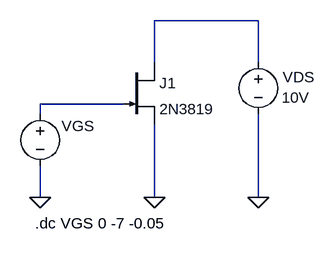
[diagram p0: schematic 2N3819_2.asc]
2N3819_2.asc, the LTspice schematic file:
Version 4.1
SHEET 1 880 680
WIRE 416 32 256 32
WIRE 256 96 256 32
WIRE 416 96 416 32
WIRE 208 160 80 160
WIRE 80 176 80 160
WIRE 80 304 80 256
WIRE 256 304 256 192
WIRE 416 304 416 176
FLAG 256 304 0
FLAG 416 304 0
FLAG 80 304 0
SYMBOL njf 208 96 R0
SYMATTR InstName J1
SYMATTR Value 2N3819
SYMBOL voltage 80 160 R0
WINDOW 0 33 34 Left 2
WINDOW 3 65 175 Left 2
SYMATTR InstName VGS
SYMATTR Value ""
SYMBOL voltage 416 80 R0
WINDOW 0 38 39 Left 2
WINDOW 3 36 70 Left 2
WINDOW 123 0 0 Left 0
WINDOW 39 0 0 Left 0
SYMATTR InstName VDS
SYMATTR Value 10V
TEXT 72 344 Left 2 !.dc VGS 0 -7 -0.05

The netlist it stands for:
* 2N3819_2.asc
J1 N001 N002 0 2N3819
VGS N002 0
VDS N001 0 10V
.model NJF NJF
.model PJF PJF
.lib standard.jft
.dc VGS 0 -7 -0.05
.backanno
.end